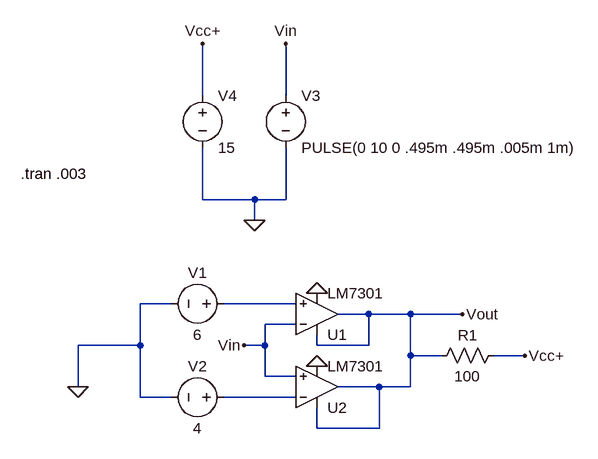
[diagram p0: schematic windowCompartor.asc]
windowCompartor.asc, the LTspice schematic file:
Version 4
SHEET 1 880 680
WIRE 224 -160 224 -240
WIRE 352 -160 352 -240
WIRE 224 0 224 -80
WIRE 304 0 224 0
WIRE 352 0 352 -80
WIRE 352 0 304 0
WIRE 304 32 304 0
WIRE 176 160 128 160
WIRE 368 160 256 160
WIRE 480 176 432 176
WIRE 544 176 480 176
WIRE 624 176 544 176
WIRE 368 192 320 192
WIRE 128 224 128 160
WIRE 128 224 32 224
WIRE 320 224 320 192
WIRE 320 224 288 224
WIRE 400 224 400 208
WIRE 480 224 480 176
WIRE 480 224 400 224
WIRE 544 240 544 176
WIRE 592 240 544 240
WIRE 720 240 672 240
WIRE 320 272 320 224
WIRE 368 272 320 272
WIRE 32 288 32 224
WIRE 496 288 432 288
WIRE 544 288 544 240
WIRE 544 288 496 288
WIRE 128 304 128 224
WIRE 176 304 128 304
WIRE 368 304 256 304
WIRE 400 352 400 320
WIRE 496 352 496 288
WIRE 496 352 400 352
FLAG 32 288 0
FLAG 288 224 Vin
FLAG 400 256 0
FLAG 400 144 0
FLAG 720 240 Vcc+
FLAG 304 32 0
FLAG 352 -240 Vin
FLAG 224 -240 Vcc+
FLAG 624 176 Vout
SYMBOL voltage 272 160 R90
WINDOW 0 -32 56 VBottom 2
WINDOW 3 32 56 VTop 2
WINDOW 123 0 0 Left 0
WINDOW 39 0 0 Left 0
SYMATTR InstName V1
SYMATTR Value 6
SYMBOL ValVol\\TI\\LM7301 400 240 M180
SYMATTR InstName U1
SYMBOL ValVol\\TI\\LM7301 400 352 M180
SYMATTR InstName U2
SYMBOL voltage 272 304 R90
WINDOW 0 -32 56 VBottom 2
WINDOW 3 32 56 VTop 2
WINDOW 123 0 0 Left 0
WINDOW 39 0 0 Left 0
SYMATTR InstName V2
SYMATTR Value 4
SYMBOL res 688 224 R90
WINDOW 0 0 56 VBottom 2
WINDOW 3 32 56 VTop 2
SYMATTR InstName R1
SYMATTR Value 100
SYMBOL voltage 352 -176 R0
WINDOW 123 0 0 Left 0
WINDOW 39 0 0 Left 0
SYMATTR InstName V3
SYMATTR Value PULSE(0 10 0 .495m .495m .005m 1m)
SYMBOL voltage 224 -176 R0
WINDOW 123 0 0 Left 0
WINDOW 39 0 0 Left 0
SYMATTR InstName V4
SYMATTR Value 15
TEXT -56 -40 Left 2 !.tran .003

The netlist it stands for:
* windowCompartor.asc
V1 N001 0 6
* U1: LM7301 (symbol ValVol\TI\LM7301 not available, pins judged from their places): In+=N001 In-=Vin V+=Vout V-=0 OUT=Vout
* U2: LM7301 (symbol ValVol\TI\LM7301 not available, pins judged from their places): In+=Vin In-=N002 V+=Vout V-=0 OUT=Vout
V2 N002 0 4
R1 Vcc+ Vout 100
V3 Vin 0 PULSE(0 10 0 .495m .495m .005m 1m)
V4 Vcc+ 0 15
.tran .003
.backanno
.end